# EasyEDA Pro project ProPrj_两相交错电源demo_2025-05-26.epro, schematic Schematic4
Board Name: Board4; Create Date: 2025-04-17; Page Name: P1; Project Name: 两相交错电源demo; Schematic Name: Schematic4; Update Date: 2025-04-17; Company: 嘉立创EDA; Page Size: A4; Version: V1.0
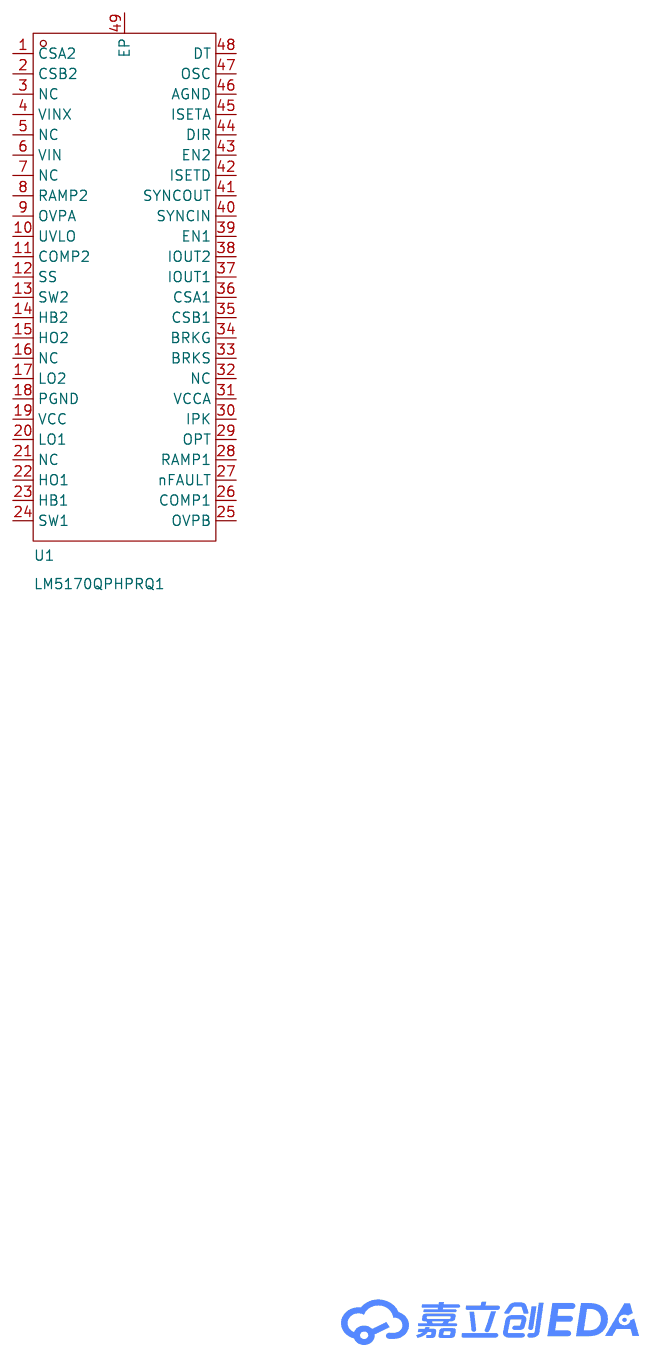
[diagram p4: schematic sheet]

## Parts
U1  LM5170QPHPRQ1  [TQFP-48_L7.0-W7.0-P0.50-LS9.0-BL-EP4.1]

## Library data of the parts
U1 = LM5170QPHPRQ1: 功能类型:升降压型;输出类型:可调;输入电压:32V~70V;输出电压:-;输出电流:30A;; LCSC Part Name: LM5170-Q1多相双向电流控制器; Supplier Part: C2658819; Manufacturer: TI(德州仪器); Supplier Footprint: HTQFP-48(7x7); JLCPCB Part Class: 扩展库; Datasheet: https://www.ti.com/cn/lit/gpn/lm5170-q1; Supplier: LCSC; Function: 升降压型; Output Type: 可调; Input Voltage: 32V~70V; Output Current: 30A; Switching Frequency: 50kHz~500kHz; Operating Temperature: -40℃~+150℃; Synchronous Rectification: 是; Number of Outputs: 2; Topology: 半桥式; Quiescent Current (Iq): 10uA; Switch tube (built-in/external): 外置

## Nets

Not connected (* = marked no-connect by the designer): U1 1(CSA2) 2(CSB2) 3(NC) 4(VINX) 5(NC) 6(VIN) 7(NC) 8(RAMP2) 9(OVPA) 10(UVLO) 11(COMP2) 12(SS) 13(SW2) 14(HB2) 15(HO2) 16(NC) 17(LO2) 18(PGND) 19(VCC) 20(LO1) 21(NC) 22(HO1) 23(HB1) 24(SW1) 25(OVPB) 26(COMP1) 27(nFAULT) 28(RAMP1) 29(OPT) 30(IPK) 31(VCCA) 32(NC) 33(BRKS) 34(BRKG) 35(CSB1) 36(CSA1) 37(IOUT1) 38(IOUT2) 39(EN1) 40(SYNCIN) 41(SYNCOUT) 42(ISETD) 43(EN2) 44(DIR) 45(ISETA) 46(AGND) 47(OSC) 48(DT) 49(EP)
